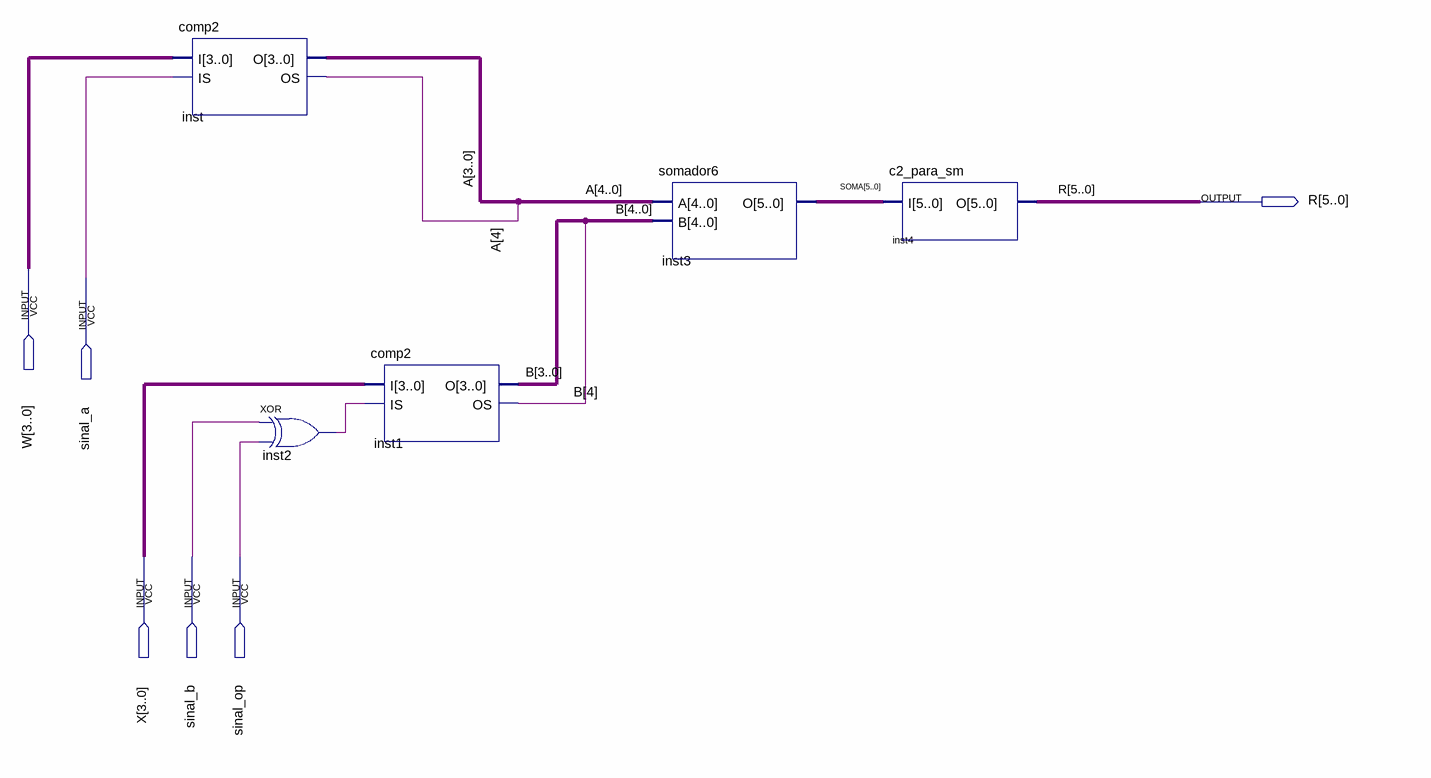
[diagram p0: schematic sheet]
// Quartus schematic somador_subtrator.bdf as structural Verilog: 5 symbols, 6 pins
module somador_subtrator (
  input  [3:0] W,
  input  sinal_a,
  input  [3:0] X,
  input  sinal_b,
  input  sinal_op,
  output [5:0] R
);

  wire inst2_out;
  wire [4:0] A, B;
  wire [5:0] SOMA;

  comp2 inst (.I(W), .IS(sinal_a), .O(A[3:0]), .OS(A[4]));
  xor inst2 (inst2_out, sinal_b, sinal_op);
  comp2 inst1 (.I(X), .IS(inst2_out), .O(B[3:0]), .OS(B[4]));
  somador6 inst3 (.A(A), .B(B), .O(SOMA));
  c2_para_sm inst4 (.I(SOMA), .O(R));
endmodule
